# EAGLE design efm_slide (EAGLE 7.1.0)
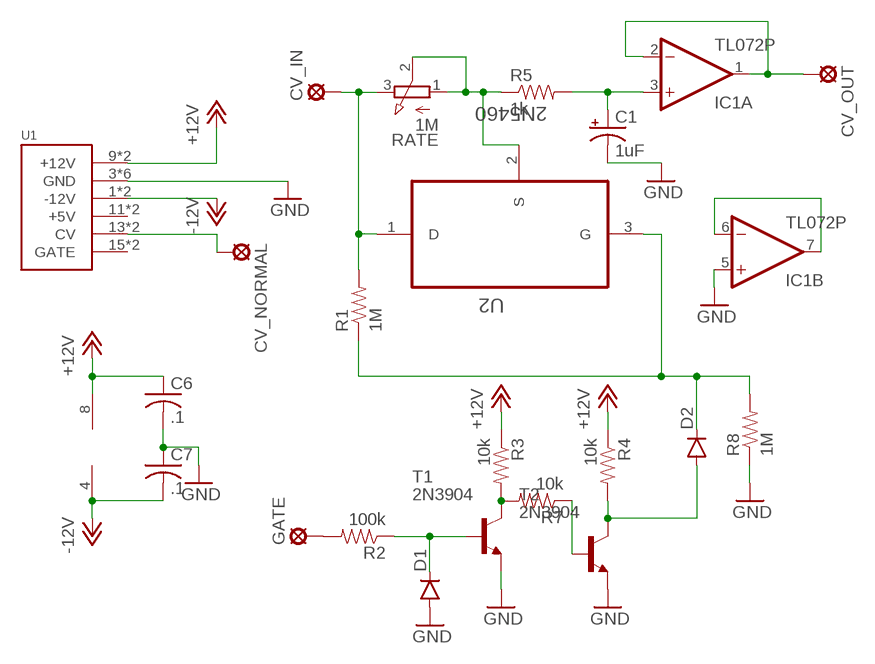
[diagram p0: schematic, sheet 1]

## Parts
C1  1uF  CPOL-USB45181A  [B45181A]
C6  .1  C-US025-024X044  [C025-024X044]
C7  .1  C-US025-024X044  [C025-024X044]
CV_IN  LSP10  [LSP10]
CV_NORMAL  LSP10  [LSP10]
CV_OUT  LSP10  [LSP10]
D1  DIODEKIT  [DIODE-1N4148-KIT]
D2  DIODEKIT  [DIODE-1N4148-KIT]
GATE  LSP10  [LSP10]
IC1  TL072P  [DIL08]
R1  1M  RESISTORPTH-1/4W  [AXIAL-0.4]
R2  100k  RESISTORPTH-1/4W  [AXIAL-0.4]
R3  10k  RESISTORPTH-1/4W  [AXIAL-0.4]
R4  10k  RESISTORPTH-1/4W  [AXIAL-0.4]
R5  1k  RESISTORPTH-1/4W  [AXIAL-0.4]
R7  10k  RESISTORPTH-1/4W  [AXIAL-0.4]
R8  1M  RESISTORPTH-1/4W  [AXIAL-0.4]
RATE  1M  3RP/1610N  [3RP/1610N]
T1  2N3904  [TO92]
T2  2N3904  [TO92]
U1  POWER  [POWER_16]
U2  2N5460  [TO127P254X732-3]

## Nets
+12V: C6.1 IC1.8(P:V+) R3.P$1 R4.P$1 U1.9(+12V) U1.10(+12V)
-12V: C7.2 IC1.4(P:V-) U1.1(-12V) U1.2(-12V)
GND: C1.- C6.2 C7.1 D1.A IC1.5(B:+IN) R8.P$1 T1.3(E) T2.3(E) U1.3(GND) U1.4(GND) U1.5(GND) U1.6(GND) U1.7(GND) U1.8(GND)
N$1: CV_NORMAL.MP U1.13(CV) U1.14(CV)
N$2: CV_IN.MP R1.P$2 RATE.3(E) U2.1(D)
N$3: R5.P$1 RATE.1(A) RATE.2(S) U2.2(S)
N$4: C1.+ IC1.3(A:+IN) R5.P$2
N$5: D2.C R1.P$1 R8.P$2 U2.3(G)
N$6: CV_OUT.MP IC1.1(A:OUT) IC1.2(A:-IN)
N$7: D1.C R2.P$1 T1.2(B)
N$8: GATE.MP R2.P$2
N$9: R3.P$2 R7.P$2 T1.1(C)
N$10: R7.P$1 T2.2(B)
N$11: IC1.6(B:-IN) IC1.7(B:OUT)
N$12: D2.A R4.P$2 T2.1(C)
Unconnected: U1.11(+5V) U1.12(+5V) U1.15(GATE) U1.16(GATE)

## Library data of the parts
C1 = rcl:CPOL-US: POLARIZED CAPACITOR, American symbol
C6 C7 = rcl:C-US: CAPACITOR, American symbol
CV_IN CV_NORMAL CV_OUT GATE = solpad:LSP10: SOLDER PAD drill 1.0 mm, distributor Buerklin, 12H555
D1 D2 = SparkFun-DiscreteSemi:DIODE: Diode These are standard reverse protection diodes and small signal diodes. SMA package can handle up to about 1A. SOD-323 can handle about 200mA. What the SOD-323 package when ordering, there are some mfgs out there that are 5-pin packages.
IC1 = linear:TL072: OP AMP
R1-R5 R7 R8 = SparkFun-Resistors:RESISTOR: Resistor Basic schematic elements and footprints for 0603, 1206, and PTH resistors.
RATE = pot:3RP/1610N: 16mm Potentiometer one level Source: http://www.alphapotentiometers.net/html/16mm_pot_2.html
T1 T2 = transistor:2N3904: NPN TRANSISTOR
U1 = eurorack:POWER
U2 = Fairchild_By_element14_Batch_1:2N5460: Transistor; MPN: 2N5460; OC_FARNELL: 1467940; OC_NEWARK: 58K2810; PACKAGE: TO-92; SUPPLIER: Fairchild

## Board
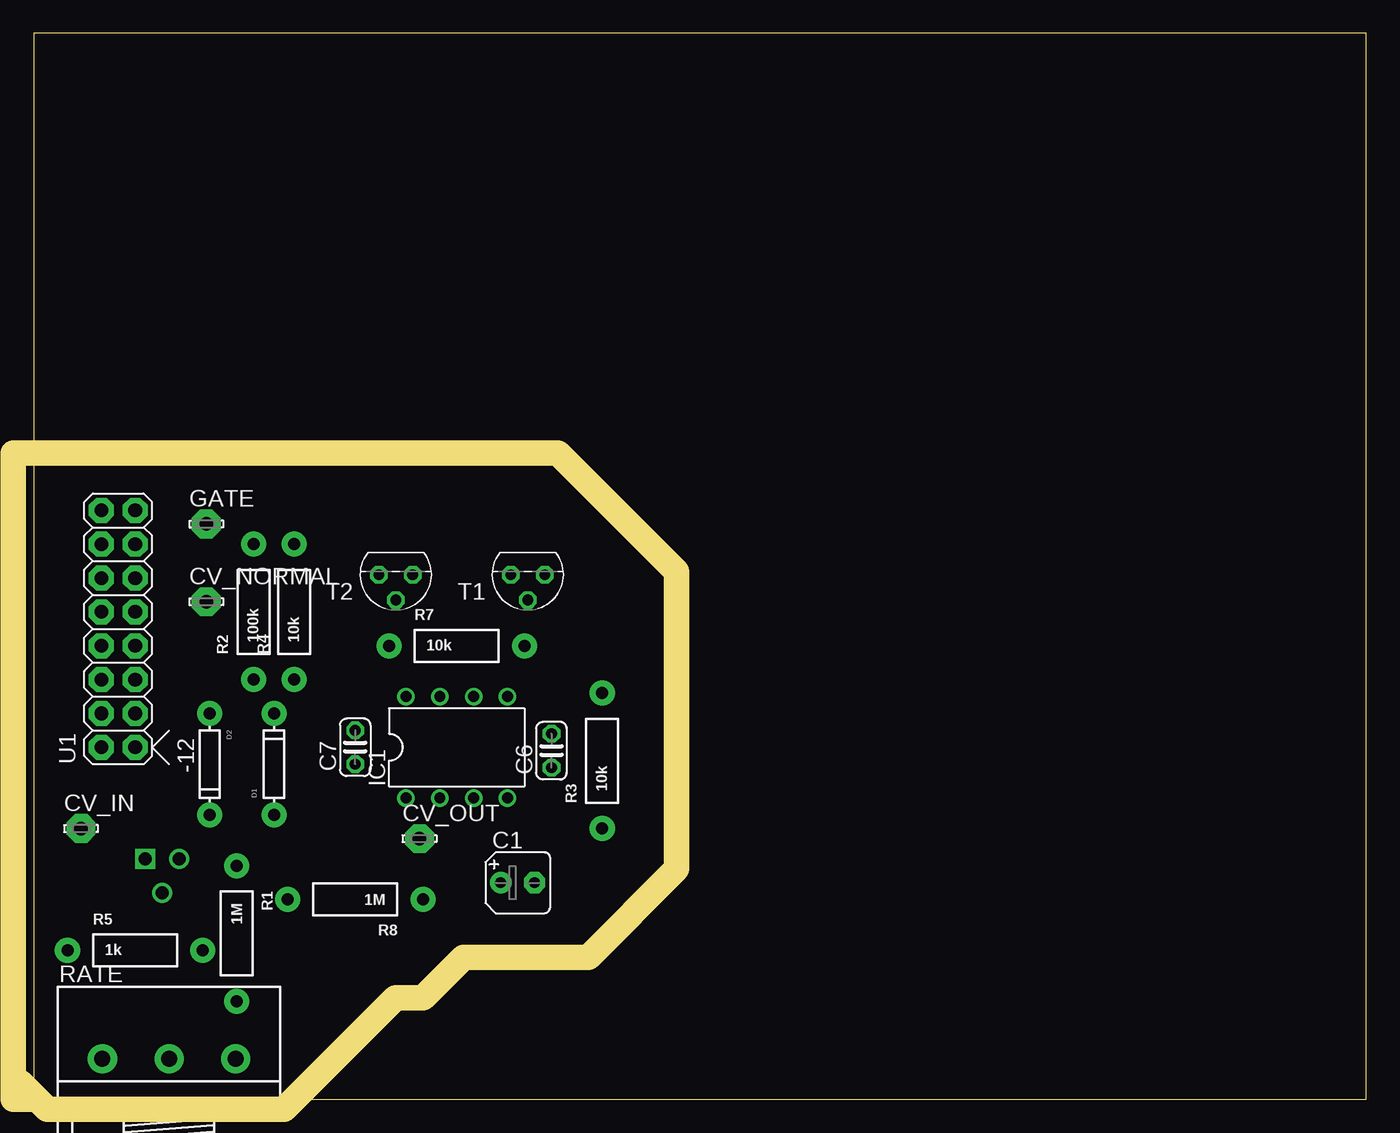
[diagram p1: board, top side]
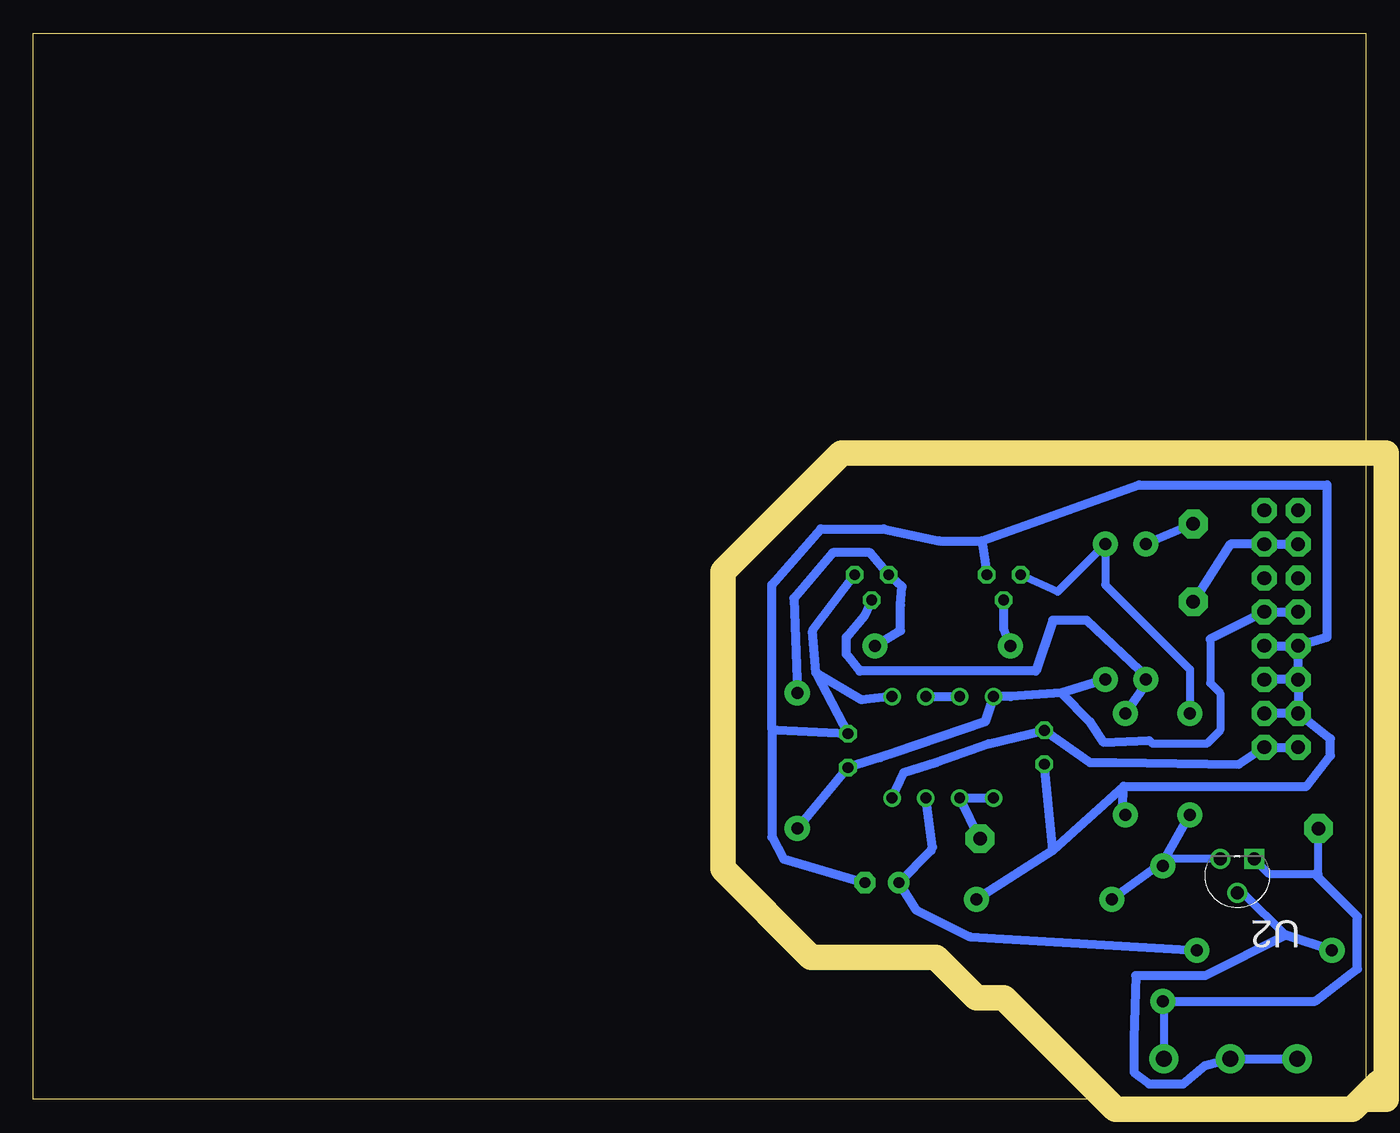
[diagram p2: board, bottom side, seen from below]

Size 100 x 80 mm. Coordinates in mm from the lower left corner, seen from the top.
Outline: 0,0 100,0 100,80 0,80 0,0
Copper layers (1*16): Top 0.035mm / dielectric 1.5mm / Bottom 0.035mm
Design rules "default *": minimum track width 26mil, minimum drill 24mil, track to track 16mil, track to pad 16mil, pad to pad 16mil, via to via 16mil, smd to smd 8mil, copper to edge 0mil, drill to drill 8mil, minimum pad ring 10mil, minimum via ring 8mil, stop-mask expansion 4mil, vias tented up to drill 0mil, thermal gap 10mil
Milling: 12 lines

### Footprints (pad centres in the part's own frame; a part is rotated, then mirrored left to right if it is on the bottom)
B45181A = drill 0.813 pad 1.6: + -1.27,0 | drill 0.813 pad 1.6 octagon: - 1.27,0
C025-024X044 = drill 0.813 octagon: 1 -1.27,0; 2 1.27,0
LSP10 = drill 1.016 pad 2.159 octagon: MP 0,0
DIODE-1N4148-KIT = drill 0.9 pad 1.88: A -3.81,0; C 3.81,0
DIL08 = drill 0.813 pad 1.27: 1 -3.81,-3.81; 2 -1.27,-3.81; 3 1.27,-3.81; 4 3.81,-3.81; 5 3.81,3.81; 6 1.27,3.81; 7 -1.27,3.81; 8 -3.81,3.81
AXIAL-0.4 = drill 0.9 pad 1.88: P$1 -5.08,0; P$2 5.08,0
3RP/1610N = drill 1.2 pad 2.184: 1 -5,0; 2 0,0; 3 5,0
TO92 = drill 0.813 octagon: 1 1.27,0; 2 0,1.905; 3 -1.27,0
POWER_16 = drill 1.016 pad 1.88 octagon: 1 -6.35,-1.27; 2 -6.35,1.27; 3 -3.81,-1.27; 4 -3.81,1.27; 5 -1.27,-1.27; 6 -1.27,1.27; 7 1.27,-1.27; 8 1.27,1.27; 9 3.81,-1.27; 10 3.81,1.27; 11 6.35,-1.27; 12 6.35,1.27; 13 8.89,-1.27; 14 8.89,1.27; 15 11.43,-1.27; 16 11.43,1.27
TO127P254X732-3 = drill 0.991 square: 1 -2.54,-2.54 | drill 0.991: 2 -1.27,0; 3 0,-2.54

### Placement (x,y rotation side)
C1  36.32,16.26 0 top
C6  38.86,26.16 90 top
C7  24.13,26.42 90 top
CV_IN  3.56,20.32 0 top
CV_NORMAL  12.95,37.34 0 top
CV_OUT  28.96,19.56 0 top
D1  18.03,25.15 90 top
D2  13.21,25.15 270 top
GATE  12.95,43.18 0 top
IC1  31.75,26.42 0 top
R1  15.24,12.45 270 top
R2  16.51,36.58 90 top
R3  42.67,25.4 90 top
R4  19.56,36.58 90 top
R5  7.62,11.18 0 top
R7  31.75,34.04 0 top
R8  24.13,14.99 180 top
RATE  10.16,3.05 0 top
T1  37.08,39.37 180 top
T2  27.18,39.37 180 top
U1  6.35,32.77 90 top
U2  10.92,15.49 180 bottom

### Tracks (layer width: path | path; a pad name or v marks a point on that pad's centre or on a via)
+12V
  Bottom 0.61: 11.68,34.54 11.68,31.24 10.92,30.48 10.92,27.69 11.94,26.67 16,26.67 16.26,26.92
  Bottom 0.66: U1.10 U1.9 11.68,34.54 | R3.P$1 C6.1 36.45,25.65 35.31,26.04 28.57,28.32 IC1.8 26.67,30.23 22.86,30.48 | R4.P$1 22.86,30.48 | 16.26,26.92 19.68,26.8 20.7,28.32 22.86,30.48
-12V
  Bottom 0.66: U1.2 U1.1 9.53,25.15 18.8,25.27 20.7,25.27 C7.2 28.32,26.67 32.26,25.27 34.67,24.51 IC1.4
GND
  Bottom 0.66: U1.7 U1.8 | U1.6 U1.4 | U1.4 U1.3 | U1.6 U1.5 | U1.6 U1.8 | 18.16,23.5 18.29,21.84 D1.A | 18.16,23.5 23.5,18.67 | 23.5,18.67 C7.1 | 23.5,18.67 R8.P$1 | U1.4 2.67,27.05 2.67,25.78 4.45,23.5 18.16,23.5 | 41.27,32 37.85,29.97 IC1.5 | 41.27,32 C6.2 44.2,27.69 44.58,27.81 | 28.83,41.91 32,41.91 36.2,42.8 40.89,42.8 44.58,38.61 44.58,27.81 | T1.3 41.53,35.18 41.27,32 | C1.- 43.69,18.03 44.58,19.68 44.58,27.81 | U1.8 2.92,34.67 2.92,46.1 17.02,46.1 28.83,41.91 | 28.83,41.91 T2.3
N$1
  Bottom 0.66: U1.14 U1.13 10.16,41.66 CV_NORMAL.MP
N$2
  Bottom 0.61: R1.P$2 15.16,7.37 RATE.3 | CV_IN.MP 3.56,16.89 3.81,16.89 7.24,16.89 U2.1
  Bottom 0.66: 3.81,16.89 0.64,13.72 0.64,9.78 3.81,7.37 R1.P$2
N$3
  Bottom 0.61: U2.2 9.22,15.49 6.02,12.29
  Bottom 0.66: RATE.1 RATE.2 12.06,2.54 13.72,1.14 16.26,1.14 17.4,2.03 17.4,4.57 17.27,9.27 12.06,9.27 6.02,12.29 5.97,12.32 R5.P$1
N$4
  Bottom 0.66: IC1.3 32.51,18.92 32.64,18.67 C1.+ 33.78,14.22 29.72,12.19 R5.P$2
N$5
  Bottom 0.61: U2.3 14.73,18.03 R1.P$1 15.24,17.94 15.02,18.16
  Bottom 0.66: R8.P$2 15.24,17.78 15.02,18.16 D2.C
N$6
  Bottom 0.66: IC1.1 IC1.2 CV_OUT.MP
N$7
  Bottom 0.66: T1.2 37.59,36.32 38.99,34.67 38.99,33.4 37.97,32.13 24.77,32.13 23.5,35.94 20.95,35.94 16.26,31.5 | R2.P$1 16.26,31.5 | 16.26,31.5 D1.C
N$8
  Bottom 0.66: GATE.MP R2.P$2
N$9
  Bottom 0.66: R7.P$2 34.92,35.18 34.92,37.08 34.8,38.48 T1.1 37.21,41.02 40.01,41.02 42.93,37.59 R3.P$2
N$10
  Bottom 0.66: T2.2 27.18,35.31 R7.P$1
N$11
  Bottom 0.66: IC1.6 IC1.7
N$12
  Bottom 0.61: T2.1 23.11,38.1 R4.P$2 19.56,38.61 13.21,32.26 D2.A